# EAGLE schematic schematic (EAGLE 9.2.0)

## Sheet 1 of 4
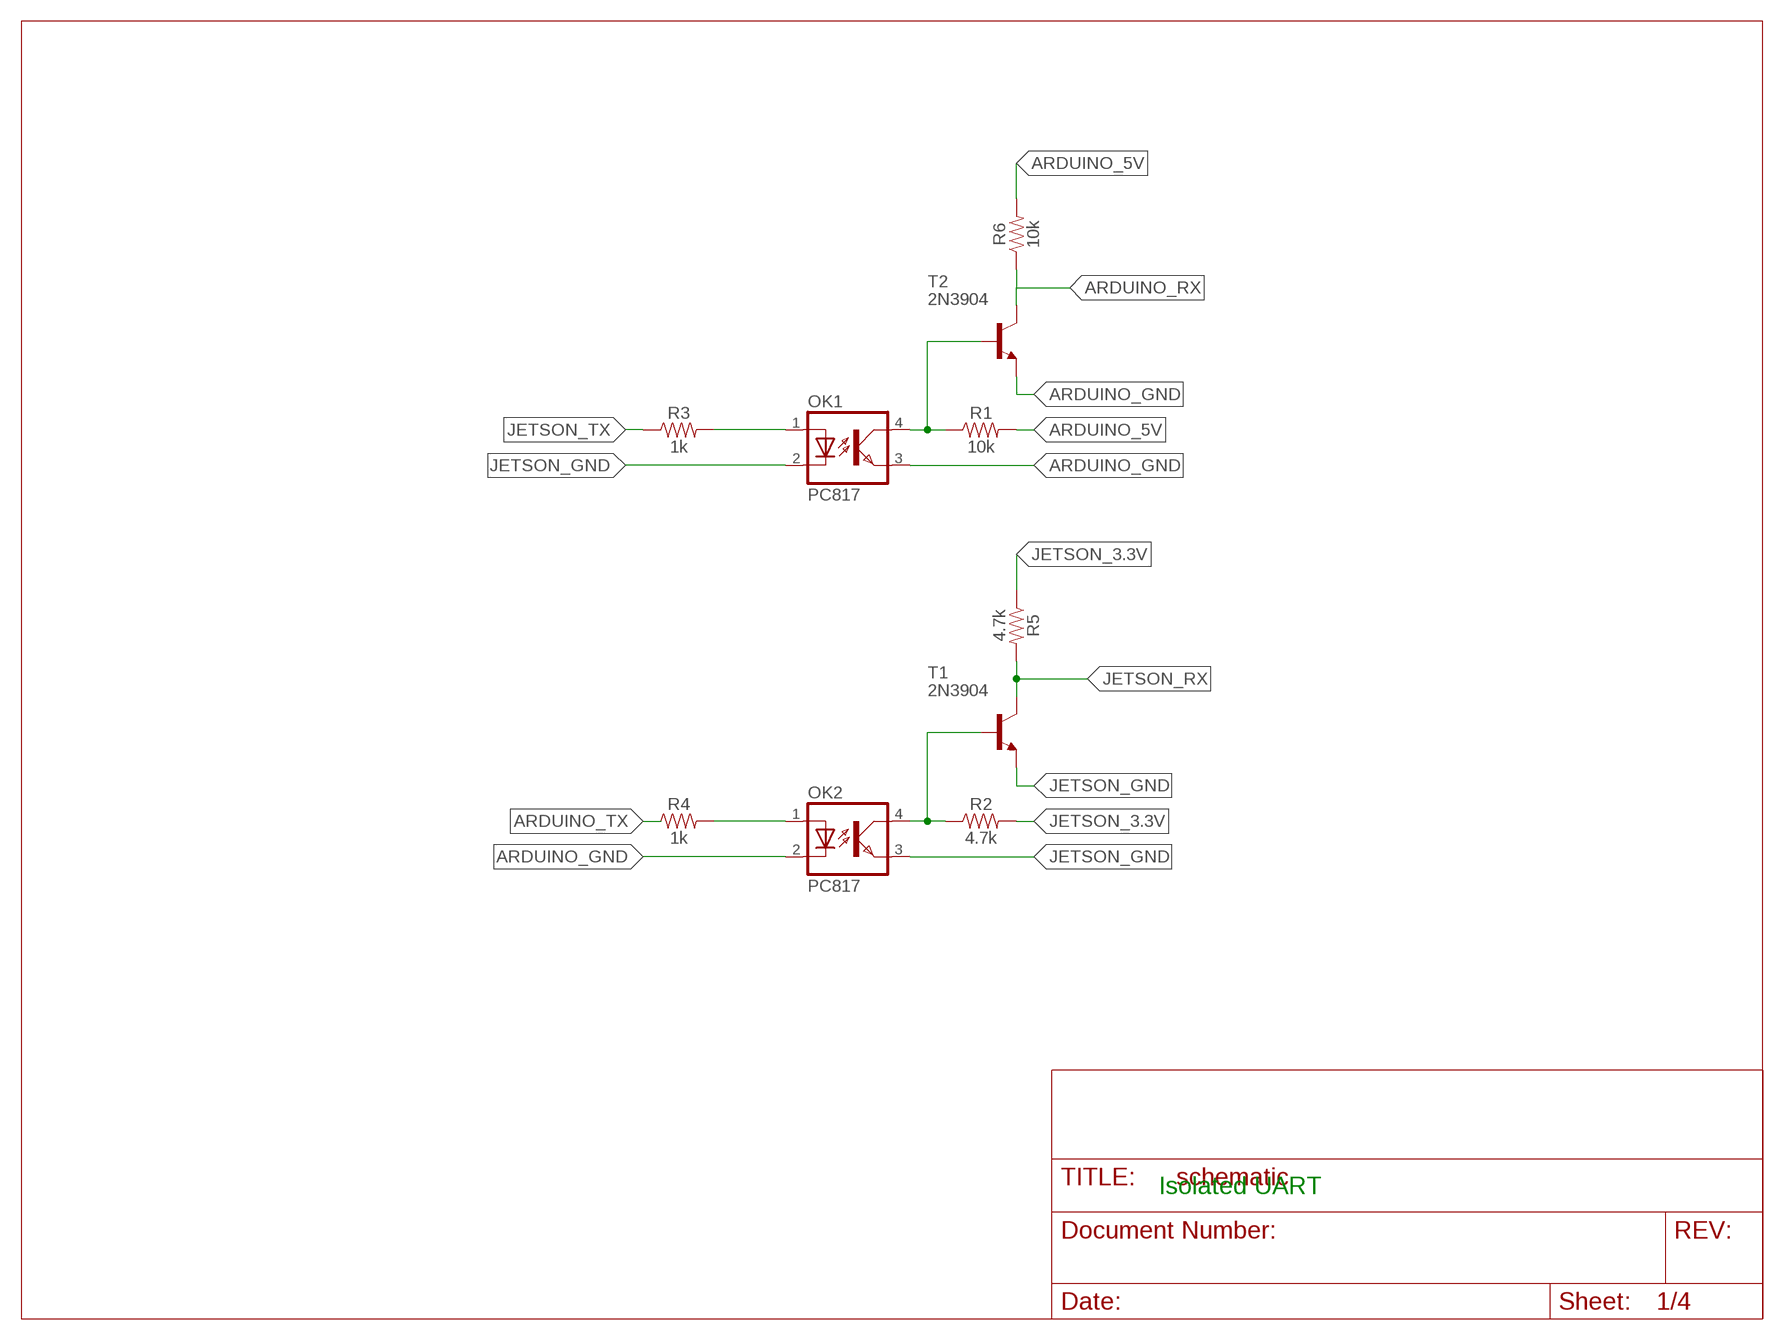
[diagram p0: schematic, sheet 1]

### Parts
OK1  PC817  [DIL04]
OK2  PC817  [DIL04]
R1  10k  1KOHM-HORIZ-1/4W-1%  [AXIAL-0.3]
R2  4.7k  1KOHM-HORIZ-1/4W-1%  [AXIAL-0.3]
R3  1k  1KOHM-HORIZ-1/4W-1%  [AXIAL-0.3]
R4  1k  1KOHM-HORIZ-1/4W-1%  [AXIAL-0.3]
R5  4.7k  1KOHM-HORIZ-1/4W-1%  [AXIAL-0.3]
R6  10k  1KOHM-HORIZ-1/4W-1%  [AXIAL-0.3]
T1  2N3904  [TO92]
T2  2N3904  [TO92]

### Nets
ARDUINO_5V: R1.P$2 R6.P$2 ; also sheet 3
ARDUINO_GND: OK1.3(EMIT) OK2.2(C) T2.3(E) ; also sheet 3,4
ARDUINO_RX: R6.P$1 T2.1(C) ; also sheet 3
ARDUINO_TX: R4.P$1 ; also sheet 3
JETSON_3.3V: R2.P$2 R5.P$1 ; also sheet 3
JETSON_GND: OK1.2(C) OK2.3(EMIT) T1.3(E) ; also sheet 3
JETSON_RX: R5.P$2 T1.1(C) ; also sheet 3
JETSON_TX: R3.P$1 ; also sheet 3
N: OK1.1(A) R3.P$2
N2: OK2.1(A) R4.P$2
N$3: OK2.4(COL) R2.P$1 T1.2(B)
N$4: OK1.4(COL) R1.P$1 T2.2(B)

### Notes on the sheet
- Isolated UART

## Sheet 2 of 4
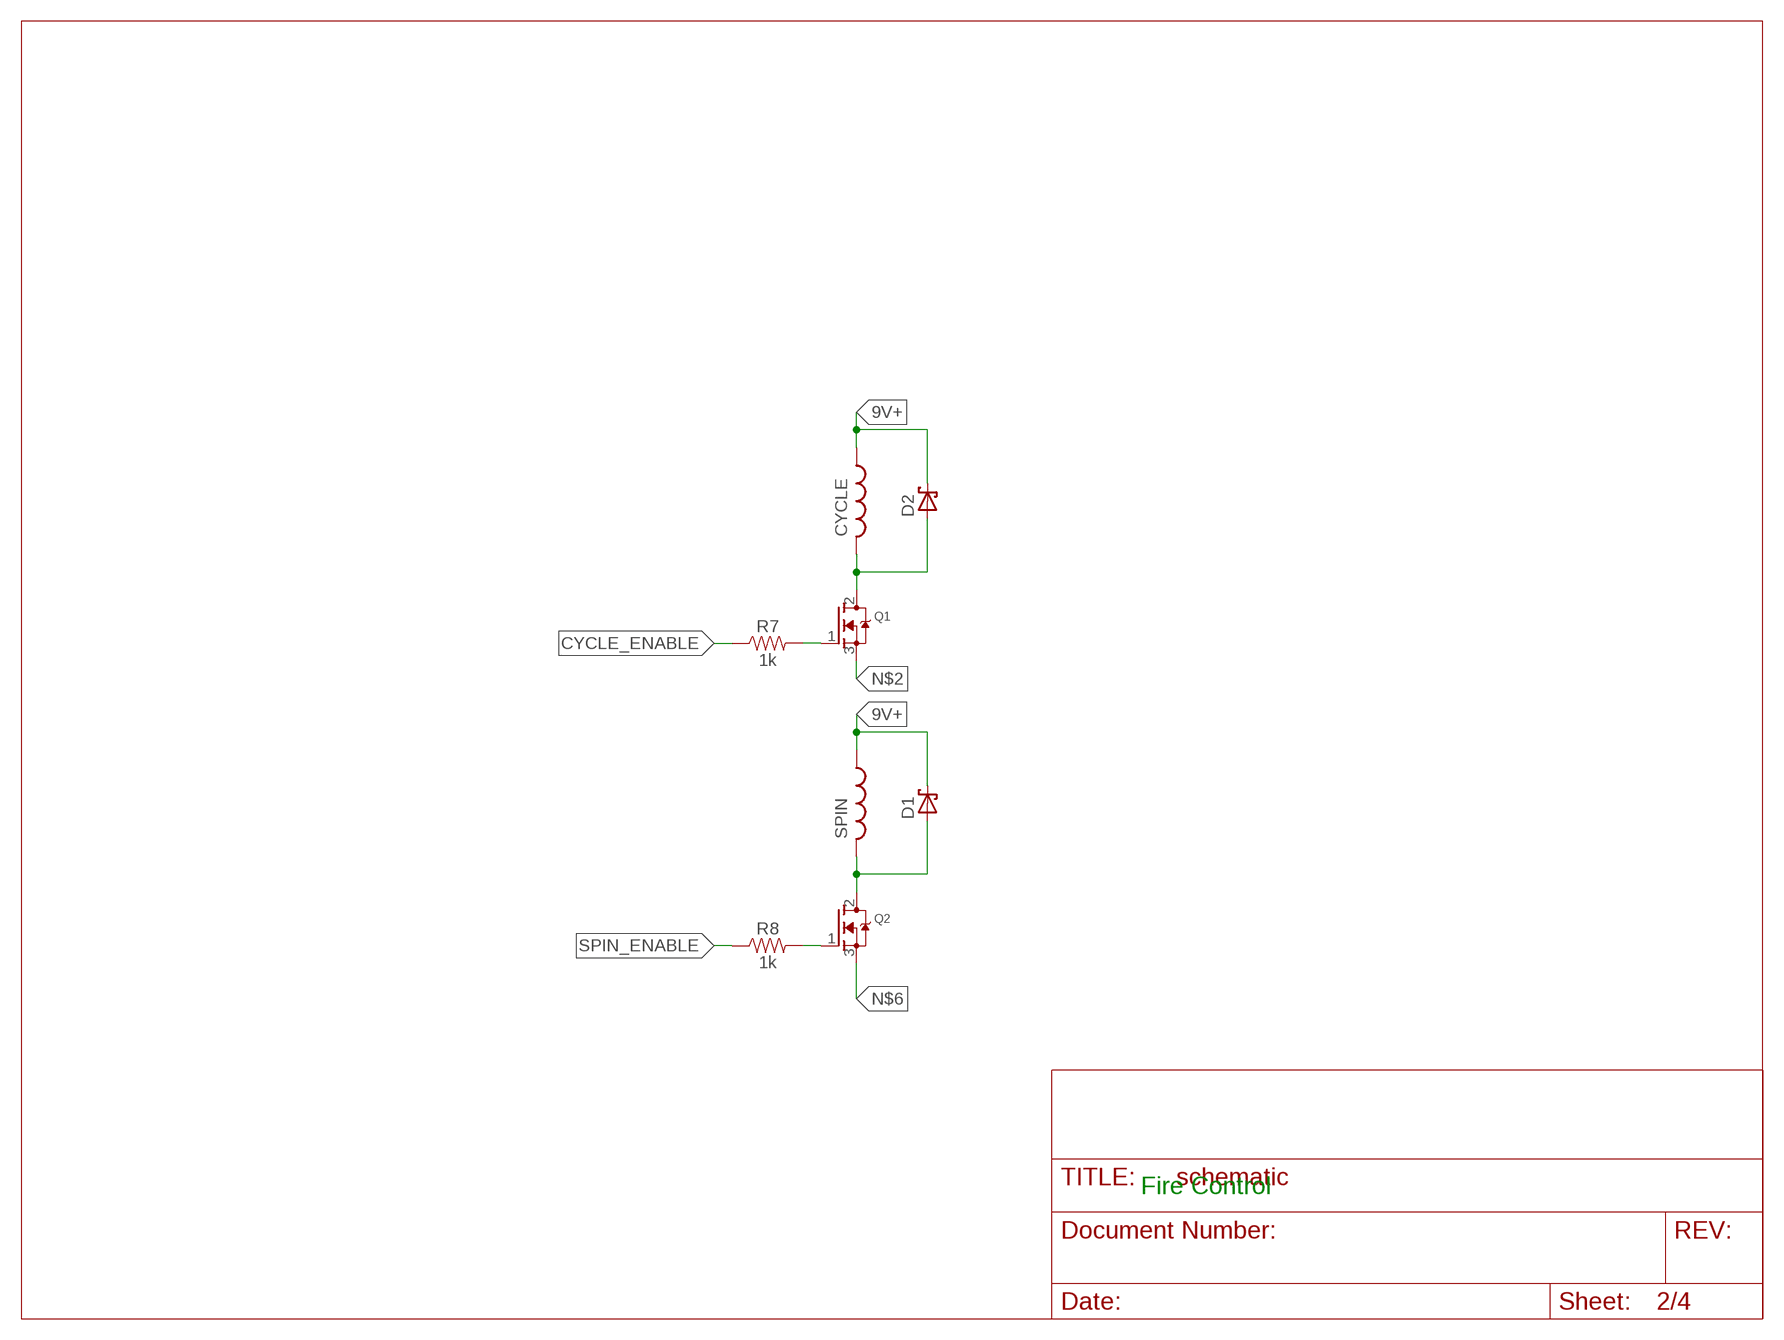
[diagram p1: schematic, sheet 2]

### Parts
CYCLE  L-US0204/5  [0204/5]
D1  SCHOTTKY-DIODECB417-15  [CB417-15]
D2  SCHOTTKY-DIODECB417-15  [CB417-15]
Q1  MOSFET-NGDS_TO220V  [TO220V]
Q2  MOSFET-NGDS_TO220V  [TO220V]
R7  1k  1KOHM-HORIZ-1/4W-5%  [AXIAL-0.3]
R8  1k  1KOHM-HORIZ-1/4W-5%  [AXIAL-0.3]
SPIN  L-US0204/5  [0204/5]

### Nets
9V+: CYCLE.1 D1.C D2.C SPIN.1 ; also sheet 3,4
9V-: CYCLE.2 D1.A D2.A Q1.2(D) Q2.2(D) SPIN.2 ; also sheet 3,4
CYCLE_ENABLE: R7.P$1 ; also sheet 3
N$2: Q1.3(S)
N$5: Q1.1(G) R7.P$2
N$6: Q2.3(S)
SPIN_ENABLE: Q2.1(G) R8.P$1 R8.P$2 ; also sheet 3

### Notes on the sheet
- Fire Control

## Sheet 3 of 4
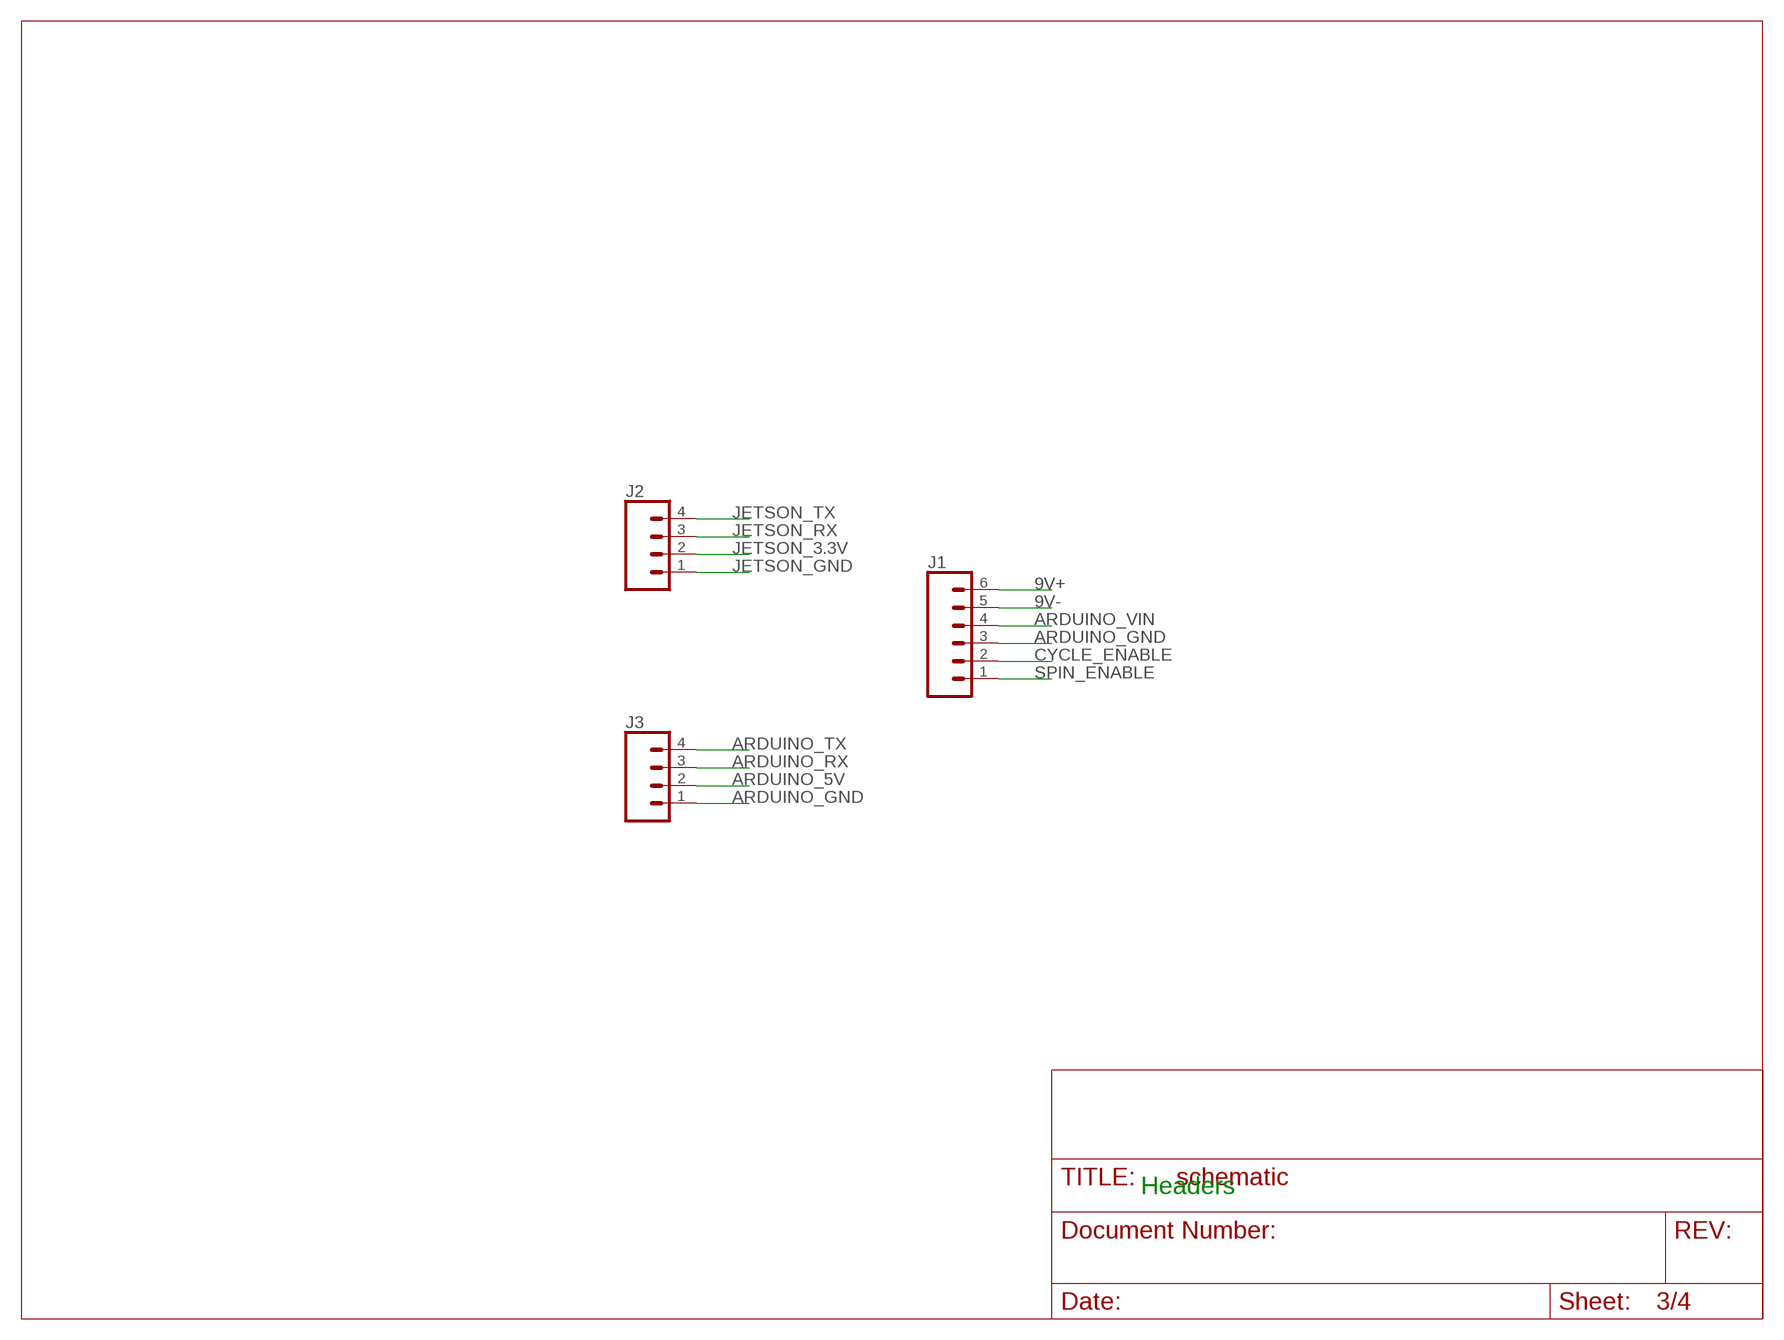
[diagram p2: schematic, sheet 3]

### Parts
J1  CONN_06SILK_FEMALE_PTH  [1X06]
J2  CONN_04  [1X04]
J3  CONN_04  [1X04]

### Nets
9V+: J1.6 ; also sheet 2,4
9V-: J1.5 ; also sheet 2,4
ARDUINO_5V: J3.2 ; also sheet 1
ARDUINO_GND: J1.3 J3.1 ; also sheet 1,4
ARDUINO_RX: J3.3 ; also sheet 1
ARDUINO_TX: J3.4 ; also sheet 1
ARDUINO_VIN: J1.4 ; also sheet 4
CYCLE_ENABLE: J1.2 ; also sheet 2
JETSON_3.3V: J2.2 ; also sheet 1
JETSON_GND: J2.1 ; also sheet 1
JETSON_RX: J2.3 ; also sheet 1
JETSON_TX: J2.4 ; also sheet 1
SPIN_ENABLE: J1.1 ; also sheet 2

### Notes on the sheet
- Headers

## Sheet 4 of 4
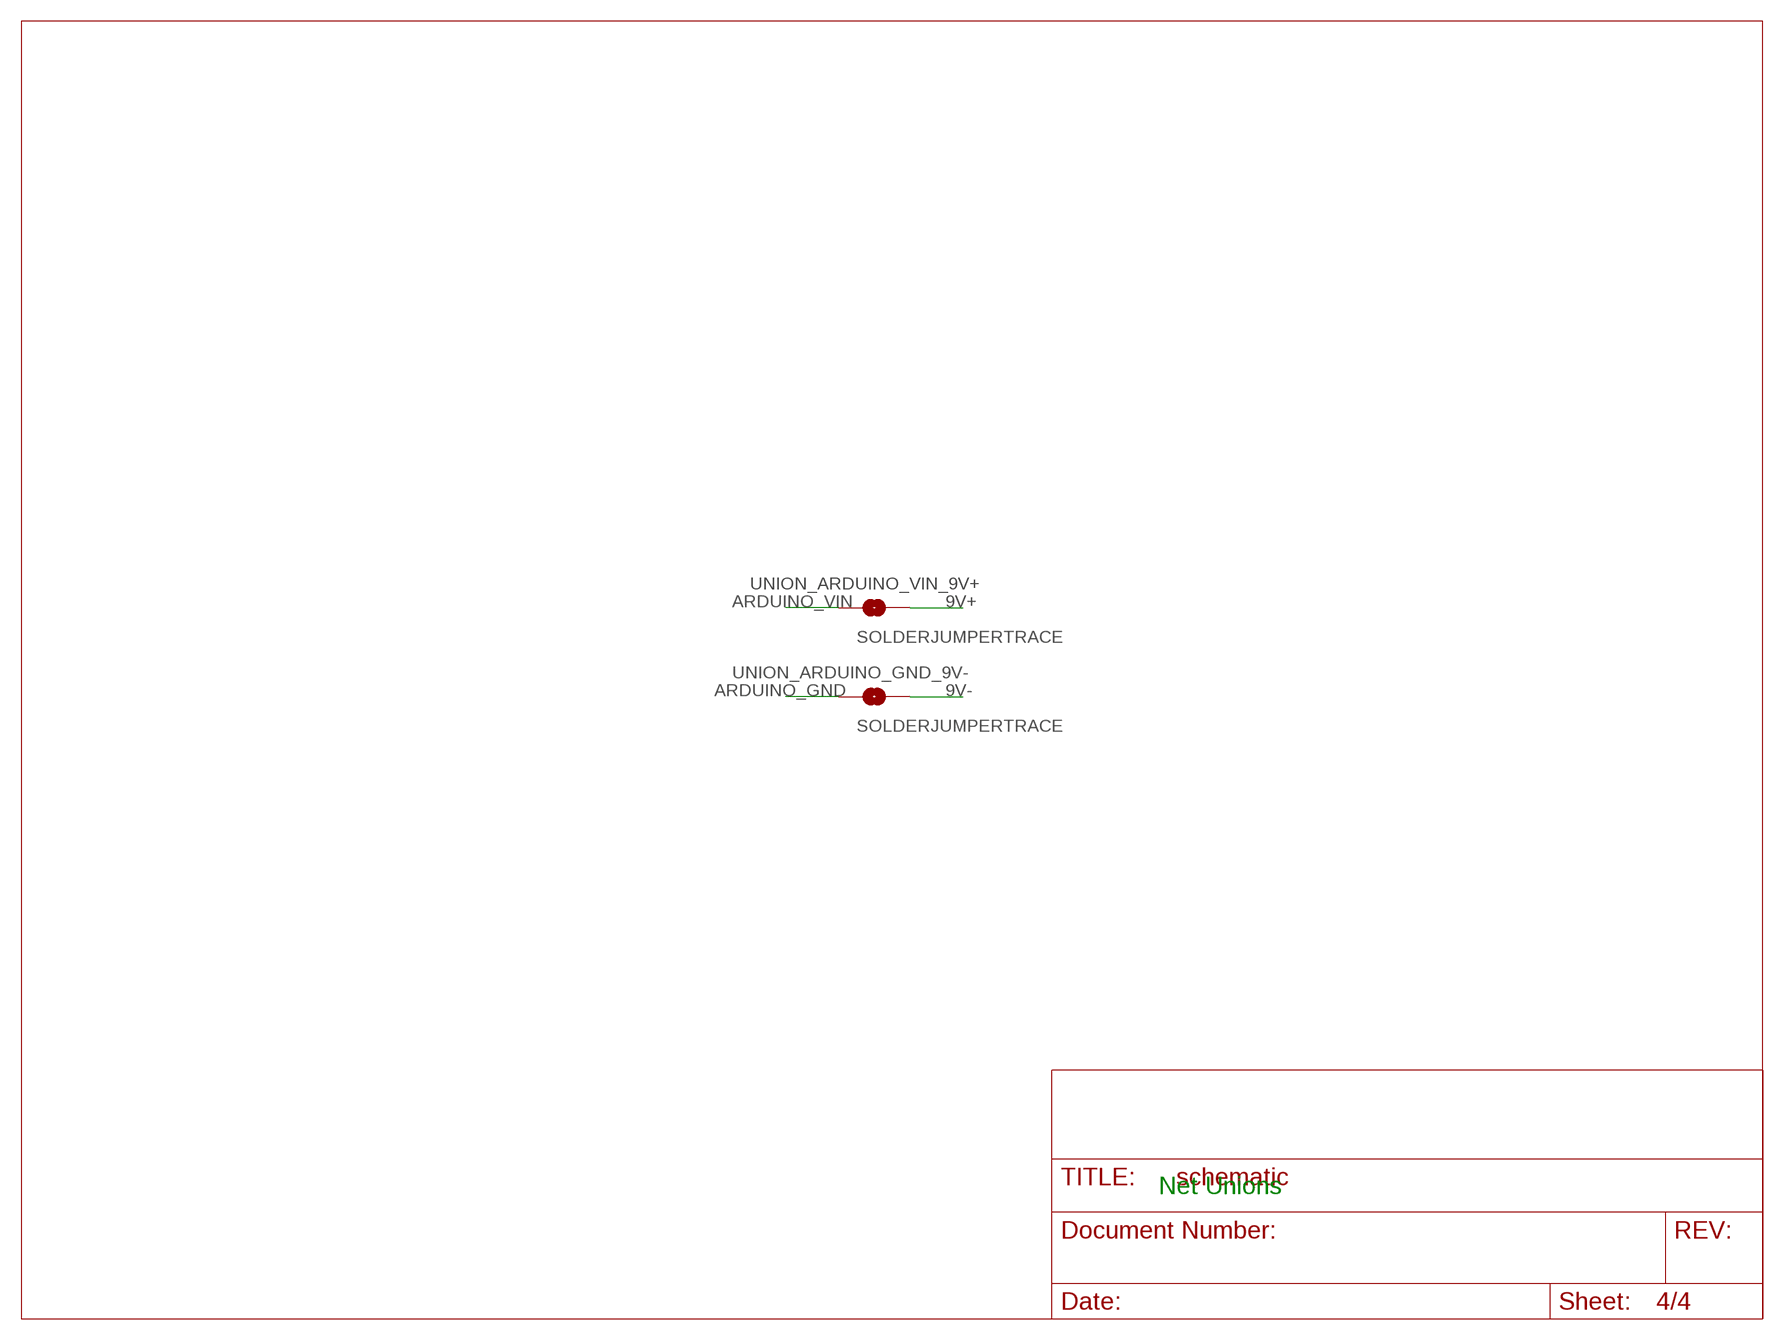
[diagram p3: schematic, sheet 4]

### Parts
UNION_ARDUINO_GND_9V-  SOLDERJUMPERTRACE  [SJ_2S-TRACE]
UNION_ARDUINO_VIN_9V+  SOLDERJUMPERTRACE  [SJ_2S-TRACE]

### Nets
9V+: UNION_ARDUINO_VIN_9V+.2 ; also sheet 2,3
9V-: UNION_ARDUINO_GND_9V-.2 ; also sheet 2,3
ARDUINO_GND: UNION_ARDUINO_GND_9V-.1 ; also sheet 1,3
ARDUINO_VIN: UNION_ARDUINO_VIN_9V+.1 ; also sheet 3

### Notes on the sheet
- Net Unions

## Library data of the parts
CYCLE SPIN = rcl:L-US: INDUCTOR, American symbol; SPICEPREFIX: L
D1 D2 = adafruit:SCHOTTKY-DIODE: Schottky Diode
J1 = SparkFun-Connectors:CONN_06: Multi connection point. Often used as Generic Header-pin footprint for 0.1 inch spaced/style header connections On any of the 0.1 inch spaced packages, you can populate with these: Break Away Headers - Straight <https://www.sparkfun.com/products/116> (PRT-00116) Break Away Male Headers - Right Angle <https://www.sparkfun.com/products/553> (PRT-00553) Female Headers <https://www.sparkfun.com/products/115> (PRT-00115) Break Away Headers - Machine Pin <https://www.sparkfun.com/products/117> (PRT-00117) Break Away Female Headers - Swiss Machine Pin <https://www.sparkfun.com/products/743> (PRT-00743) Arduino Stackable Header - 6 Pin <https://www.sparkfun.com/products/9280> (PRT-09280) For SCREWTERMINALS and SPRING TERMINALS visit here: Screw Terimnals on SparkFun.com <https://www.sparkfun.com/search/results?term=Screw+Terminals> (5mm/3.5mm/2.54mm spacing) This device is also useful as a general connection point to wire up your design to another part of your project. Our various solder wires solder well into these plated through hole pads. Hook-Up Wire - Assortment (Stranded, 22 AWG) <https://www.sparkfun.com/products/11375> (PRT-11375) Hook-Up Wire - Assortment (Solid Core, 22 AWG) <https://www.sparkfun.com/products/11367> (PRT-11367) View the entire wire category on our website here <https://www.sparkfun.com/categories/141>; PROD_ID: CONN-08437
J2 J3 = SparkFun-Connectors:CONN_04: Multi connection point. Often used as Generic Header-pin footprint for 0.1 inch spaced/style header connections On any of the 0.1 inch spaced packages, you can populate with these: Break Away Headers - Straight <https://www.sparkfun.com/products/116> (PRT-00116) Break Away Male Headers - Right Angle <https://www.sparkfun.com/products/553> (PRT-00553) Female Headers <https://www.sparkfun.com/products/115> (PRT-00115) Break Away Headers - Machine Pin <https://www.sparkfun.com/products/117> (PRT-00117) Break Away Female Headers - Swiss Machine Pin <https://www.sparkfun.com/products/743> (PRT-00743) For SCREWTERMINALS and SPRING TERMINALS visit here: Screw Terimnals on SparkFun.com <https://www.sparkfun.com/search/results?term=Screw+Terminals> (5mm/3.5mm/2.54mm spacing) This device is also useful as a general connection point to wire up your design to another part of your project. Our various solder wires solder well into these plated through hole pads. Hook-Up Wire - Assortment (Stranded, 22 AWG) <https://www.sparkfun.com/products/11375> (PRT-11375) Hook-Up Wire - Assortment (Solid Core, 22 AWG) <https://www.sparkfun.com/products/11367> (PRT-11367) View the entire wire category on our website here <https://www.sparkfun.com/categories/141> Special notes: Molex polarized connector foot print use with SKU : PRT-08231 with associated crimp pins and housings. 1MM SMD Version SKU: PRT-10208; PROD_ID: CONN-09696
OK1 OK2 = optocoupler:PC817: SHARP OPTO COUPLER; MPN: PC817X4J000F; OC_FARNELL: 9707727; OC_NEWARK: 97K7059
Q1 Q2 = adafruit:MOSFET-N: N-Channel Mosfet 2N7002E - 60V 260mA SOT23 [Digikey: 2N7002ET1GOSTR-ND] - REEL BSH103 - 30V 850mA SOT23 [Digikey: 568-5013-1-ND]
R1 R2 R5 R6 = SparkFun-Resistors:1KOHM: 1kΩ resistor A resistor is a passive two-terminal electrical component that implements electrical resistance as a circuit element. Resistors act to reduce current flow, and, at the same time, act to lower voltage levels within circuits. - Wikipedia; PROD_ID: RES-12182; VALUE: 1k
R3 R4 = SparkFun-Resistors:1KOHM: 1kΩ resistor A resistor is a passive two-terminal electrical component that implements electrical resistance as a circuit element. Resistors act to reduce current flow, and, at the same time, act to lower voltage levels within circuits. - Wikipedia; PROD_ID: RES-12182
R7 R8 = SparkFun-Resistors:1KOHM: 1kΩ resistor A resistor is a passive two-terminal electrical component that implements electrical resistance as a circuit element. Resistors act to reduce current flow, and, at the same time, act to lower voltage levels within circuits. - Wikipedia; PROD_ID: RES-08380
T1 T2 = transistor:2N3904: NPN TRANSISTOR
UNION_ARDUINO_GND_9V- UNION_ARDUINO_VIN_9V+ = SparkFun-Retired:SOLDERJUMPER: Solder Jumper Standard SMD solder jumper. Used to automate production. Two varients : Normally Open and Normally Closed are the same, but have different paste layers. NC will have a large amount of paste and should jumper during reflow.